# Altium schematic sheet p04_buttons.SchDoc
size A
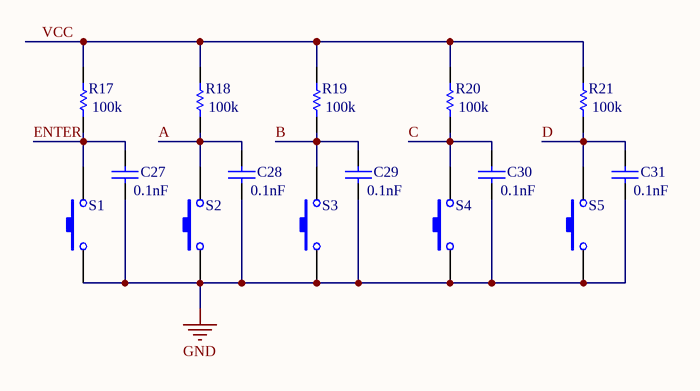
[diagram p0: p04_buttons.SchDoc]

## Parts
C27  value 0.1nF  [C0805]  (hidden comment: Cap)
C28  value 0.1nF  [C0805]  (hidden comment: Cap)
C29  value 0.1nF  [C0805]  (hidden comment: Cap)
C30  value 0.1nF  [C0805]  (hidden comment: Cap)
C31  value 0.1nF  [C0805]  (hidden comment: Cap)
R17  value 100k  [6-0805_M]  (hidden comment: Res1)
R18  value 100k  [6-0805_M]  (hidden comment: Res1)
R19  value 100k  [6-0805_M]  (hidden comment: Res1)
R20  value 100k  [6-0805_M]  (hidden comment: Res1)
R21  value 100k  [6-0805_M]  (hidden comment: Res1)
S1  SW-PB  [SPST-2]  (value not drawn)
S2  SW-PB  [SPST-2]  (value not drawn)
S3  SW-PB  [SPST-2]  (value not drawn)
S4  SW-PB  [SPST-2]  (value not drawn)
S5  SW-PB  [SPST-2]  (value not drawn)

## Nets
GND: C27.2 C28.2 C29.2 C30.2 C31.2 S1.1 S2.1 S3.1 S4.1 S5.1
A: C28.1 R18.2 S2.2
B: C29.1 R19.2 S3.2
C: C30.1 R20.2 S4.2
D: C31.1 R21.2 S5.2
ENTER: C27.1 R17.2 S1.2
VCC: R17.1 R18.1 R19.1 R20.1 R21.1

## Library data of the parts
C27-C31 = Cap: Capacitor; Published: 8-Jun-2000; LatestRevisionDate: 17-Jul-2002; LatestRevisionNote: Re-released for DXP Platform.; PackageReference: RAD-0.3; Publisher: Altium Limited; PackageDescription: Radial Cap, Thru-Hole; 2 Leads; 0.3 in Pin Spacing
R17-R21 = Res1: Resistor; Published: 8-Jun-2000; LatestRevisionDate: 17-Jul-2002; LatestRevisionNote: Re-released for DXP Platform.; PackageReference: AXIAL-0.3; Publisher: Altium Limited; PackageDescription: Axial Device, Thru-Hole; 2 Leads; 0.3 in Pin Spacing
S1-S5 = SW-PB: Switch; Published: 24-Mar-1999; LatestRevisionDate: 17-Jul-2002; LatestRevisionNote: Re-released for DXP Platform.; PackageReference: SPST-2; Publisher: Altium Limited; PackageDescription: Switch; 2 Leads